# Altium schematic sheet DM1097_CM4_HS.SchDoc: =project_title
size Tabloid; CompanyName: Luxonis Holding; Organization: Luxonis Holding; Address1: 1925 Harmony Park Drive; Address2: Westminster, CO; Address3: 80234; Address4: United States; SheetNumber: 9; SheetTotal: 17
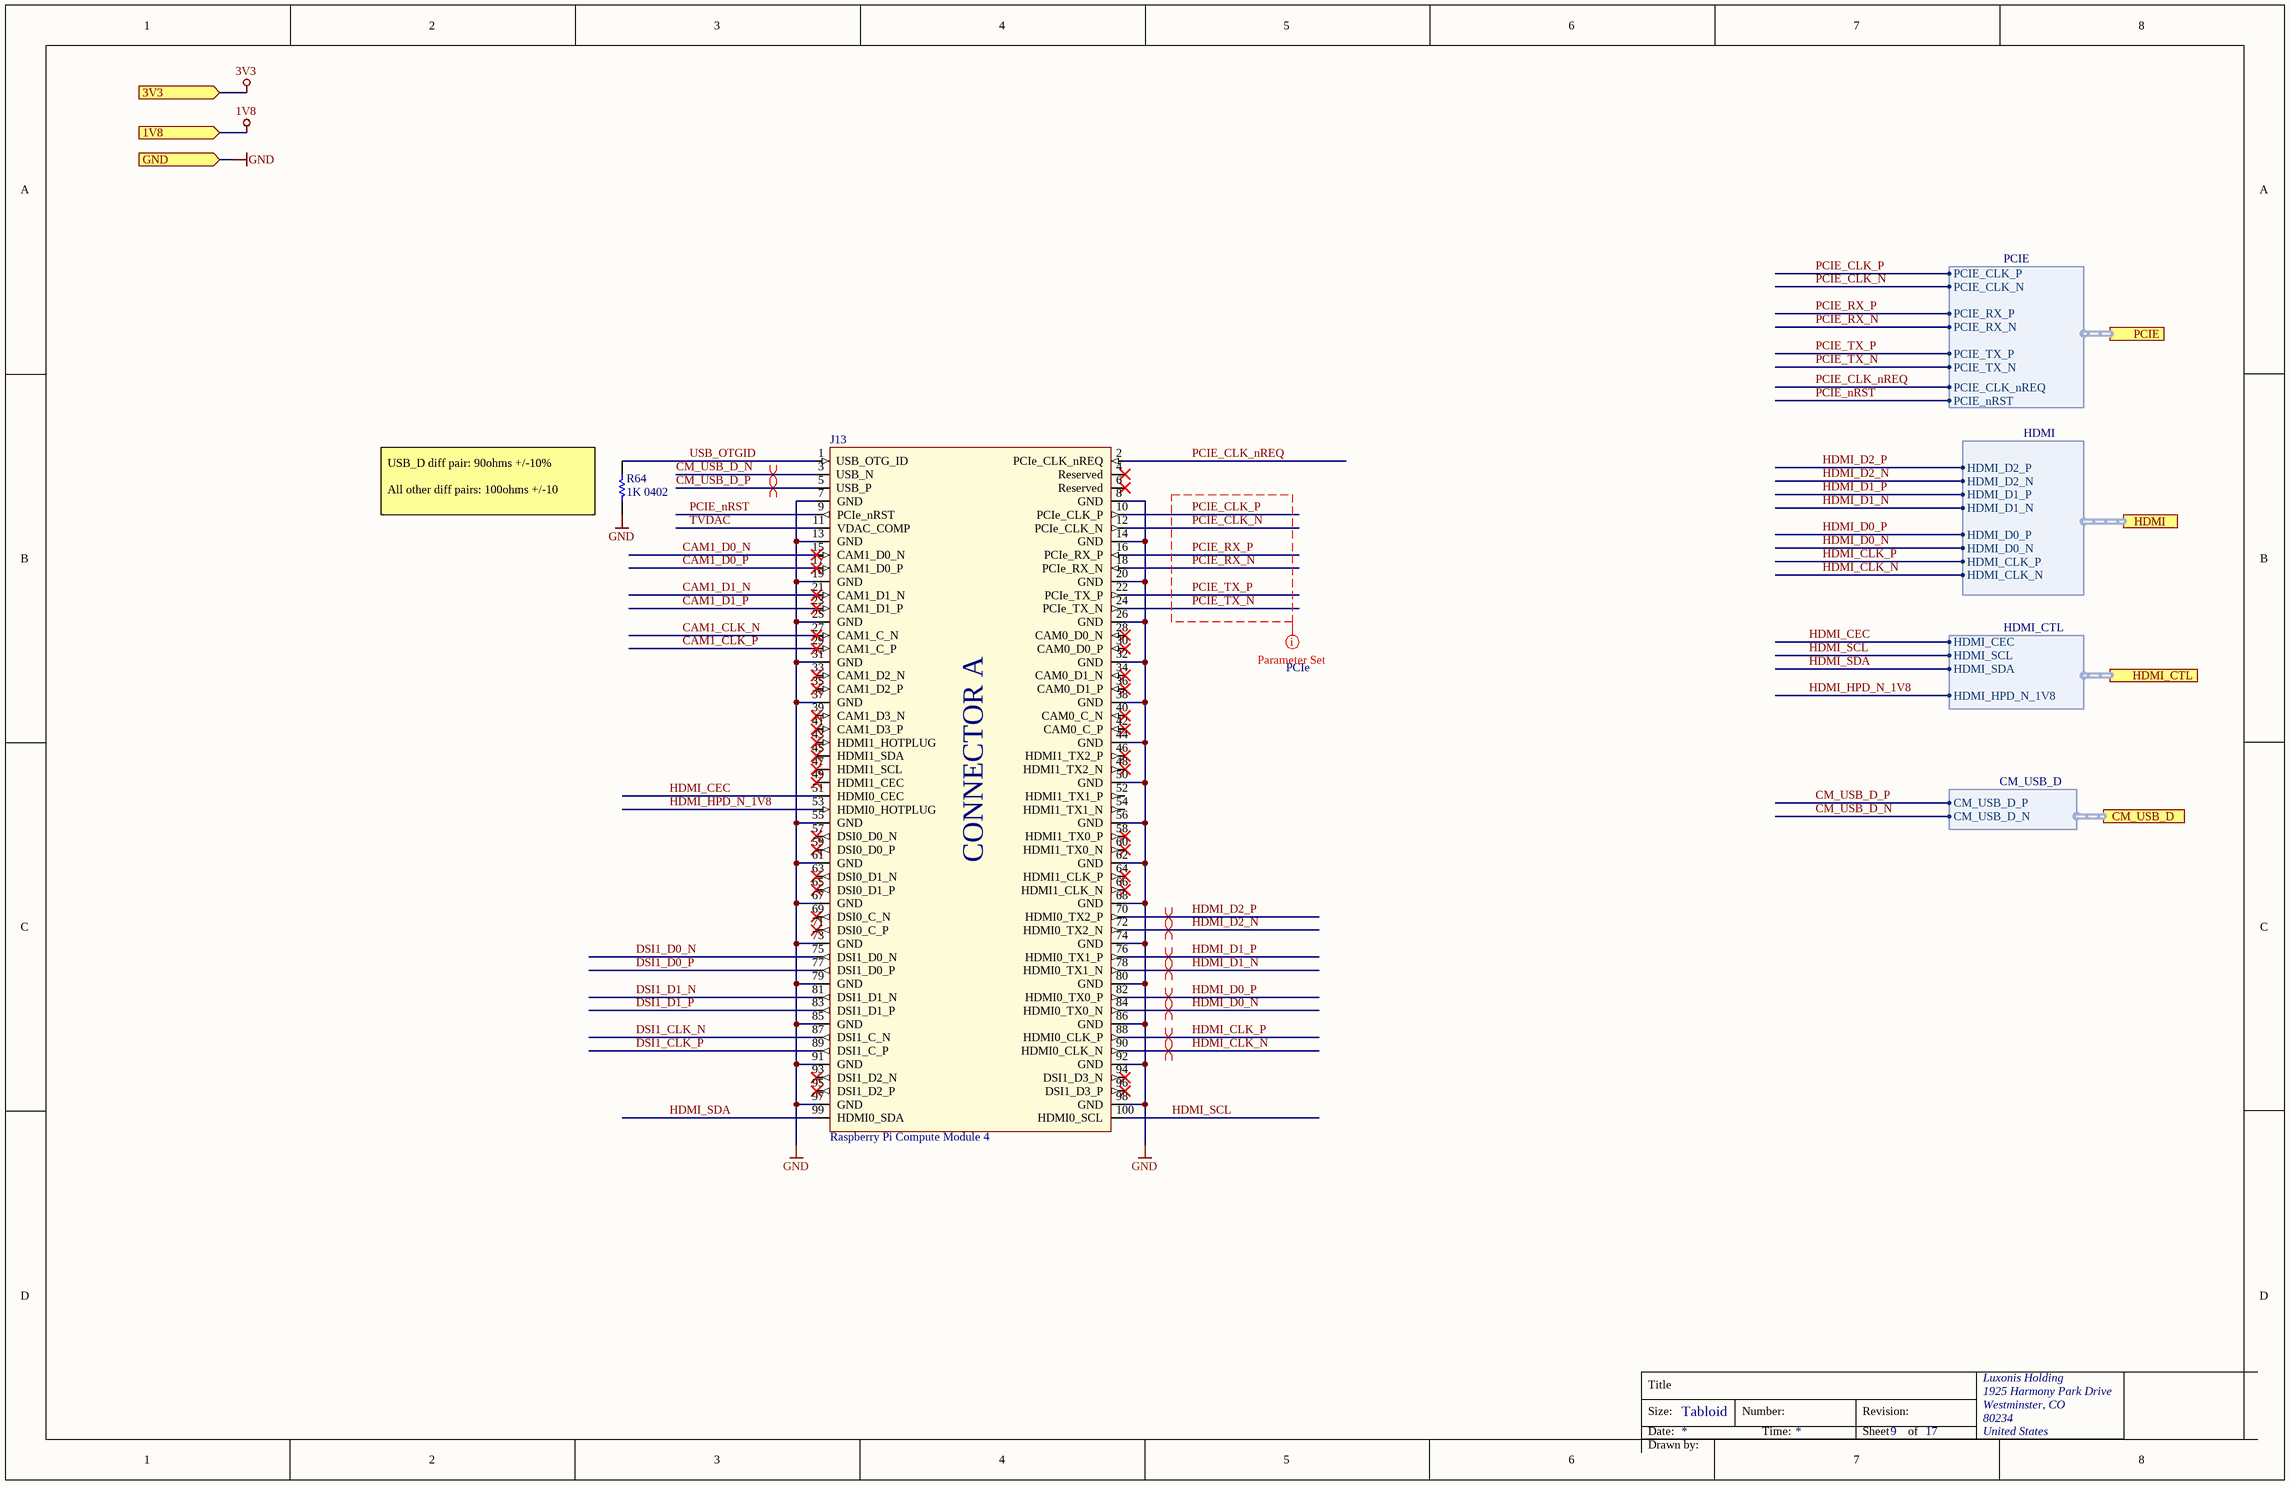
[diagram p0: DM1097_CM4_HS.SchDoc]

## Parts
J13  Raspberry Pi Compute Module 4  [CM4-Connector-A]
R64  1K 0402  [RESC0402(1005)_N]

## Ports
1V8 (in), 3V3 (in), CM_USB_D (harness CM_USB_D), GND (in), HDMI (harness HDMI), HDMI_CTL (harness HDMI_CTL), PCIE (harness PCIE)

## Harnesses
HDMI: HDMI_CLK_N, HDMI_CLK_P, HDMI_D0_N, HDMI_D0_P, HDMI_D1_N, HDMI_D1_P, HDMI_D2_N, HDMI_D2_P
CM_USB_D: CM_USB_D_P, CM_USB_D_N
HDMI_CTL: HDMI_CEC, HDMI_SCL, HDMI_SDA, HDMI_HPD_N_1V8
PCIE: PCIE_CLK_P, PCIE_CLK_N, PCIE_RX_P, PCIE_RX_N, PCIE_TX_N, PCIE_TX_P, PCIE_CLK_nREQ, PCIE_nRST

## Nets
1V8: port 1V8
3V3: port 3V3
GND: J13.7(GND) J13.8(GND) J13.13(GND) J13.14(GND) J13.19(GND) J13.20(GND) J13.25(GND) J13.26(GND) J13.31(GND) J13.32(GND) J13.37(GND) J13.38(GND) J13.44(GND) J13.50(GND) J13.55(GND) J13.56(GND) J13.61(GND) J13.62(GND) J13.67(GND) J13.68(GND) J13.73(GND) J13.74(GND) J13.79(GND) J13.80(GND) J13.85(GND) J13.86(GND) J13.91(GND) J13.92(GND) J13.97(GND) J13.98(GND) R64.1 ; port GND
CAM1_CLK_N: J13.27(CAM1_C_N)
CAM1_CLK_P: J13.29(CAM1_C_P)
CAM1_D0_N: J13.15(CAM1_D0_N)
CAM1_D0_P: J13.17(CAM1_D0_P)
CAM1_D1_N: J13.21(CAM1_D1_N)
CAM1_D1_P: J13.23(CAM1_D1_P)
CM_USB_D_N: J13.3(USB_N) ; port CM_USB_D.CM_USB_D_N
CM_USB_D_P: J13.5(USB_P) ; port CM_USB_D.CM_USB_D_P
DSI1_CLK_N: J13.87(DSI1_C_N)
DSI1_CLK_P: J13.89(DSI1_C_P)
DSI1_D0_N: J13.75(DSI1_D0_N)
DSI1_D0_P: J13.77(DSI1_D0_P)
DSI1_D1_N: J13.81(DSI1_D1_N)
DSI1_D1_P: J13.83(DSI1_D1_P)
HDMI_CEC: J13.51(HDMI0_CEC) ; port HDMI_CTL.HDMI_CEC
HDMI_CLK_N: J13.90(HDMI0_CLK_N) ; port HDMI.HDMI_CLK_N
HDMI_CLK_P: J13.88(HDMI0_CLK_P) ; port HDMI.HDMI_CLK_P
HDMI_D0_N: J13.84(HDMI0_TX0_N) ; port HDMI.HDMI_D0_N
HDMI_D0_P: J13.82(HDMI0_TX0_P) ; port HDMI.HDMI_D0_P
HDMI_D1_N: J13.78(HDMI0_TX1_N) ; port HDMI.HDMI_D1_N
HDMI_D1_P: J13.76(HDMI0_TX1_P) ; port HDMI.HDMI_D1_P
HDMI_D2_N: J13.72(HDMI0_TX2_N) ; port HDMI.HDMI_D2_N
HDMI_D2_P: J13.70(HDMI0_TX2_P) ; port HDMI.HDMI_D2_P
HDMI_HPD_N_1V8: J13.53(HDMI0_HOTPLUG) ; port HDMI_CTL.HDMI_HPD_N_1V8
HDMI_SCL: J13.100(HDMI0_SCL) ; port HDMI_CTL.HDMI_SCL
HDMI_SDA: J13.99(HDMI0_SDA) ; port HDMI_CTL.HDMI_SDA
PCIE_CLK_N: J13.12(PCIe_CLK_N) ; port PCIE.PCIE_CLK_N
PCIE_CLK_nREQ: J13.2(PCIe_CLK_nREQ) ; port PCIE.PCIE_CLK_nREQ
PCIE_CLK_P: J13.10(PCIe_CLK_P) ; port PCIE.PCIE_CLK_P
PCIE_nRST: J13.9(PCIe_nRST) ; port PCIE.PCIE_nRST
PCIE_RX_N: J13.18(PCIe_RX_N) ; port PCIE.PCIE_RX_N
PCIE_RX_P: J13.16(PCIe_RX_P) ; port PCIE.PCIE_RX_P
PCIE_TX_N: J13.24(PCIe_TX_N) ; port PCIE.PCIE_TX_N
PCIE_TX_P: J13.22(PCIe_TX_P) ; port PCIE.PCIE_TX_P
TVDAC: J13.11(VDAC_COMP)
USB_OTGID: J13.1(USB_OTG_ID) R64.2

Not connected (* = marked no-connect by the designer): J13 4(Reserved)* 6(Reserved)* 28(CAM0_D0_N)* 30(CAM0_D0_P)* 33(CAM1_D2_N)* 34(CAM0_D1_N)* 35(CAM1_D2_P)* 36(CAM0_D1_P)* 39(CAM1_D3_N)* 40(CAM0_C_N)* 41(CAM1_D3_P)* 42(CAM0_C_P)* 43(HDMI1_HOTPLUG)* 45(HDMI1_SDA)* 46(HDMI1_TX2_P)* 47(HDMI1_SCL)* 48(HDMI1_TX2_N)* 49(HDMI1_CEC)* 52(HDMI1_TX1_P) 54(HDMI1_TX1_N) 57(DSI0_D0_N)* 58(HDMI1_TX0_P)* 59(DSI0_D0_P)* 60(HDMI1_TX0_N)* 63(DSI0_D1_N)* 64(HDMI1_CLK_P)* 65(DSI0_D1_P)* 66(HDMI1_CLK_N)* 69(DSI0_C_N)* 71(DSI0_C_P)* 93(DSI1_D2_N)* 94(DSI1_D3_N)* 95(DSI1_D2_P)* 96(DSI1_D3_P)*

## Layout directives
differential pair; differential pair class 90ohm: CM_USB_D_N, CM_USB_D_P
differential pair; differential pair class 100ohm: HDMI_CLK_N, HDMI_CLK_P, HDMI_D0_N, HDMI_D0_P, HDMI_D1_N, HDMI_D1_P, HDMI_D2_N, HDMI_D2_P
net class PCIe: PCIE_CLK_N, PCIE_CLK_P, PCIE_RX_N, PCIE_RX_P, PCIE_TX_N, PCIE_TX_P

## Notes on the sheet
- (near R64) USB_D diff pair: 90ohms +/-10%
  All other diff pairs: 100ohms +/-10
- Title
- Size:
- Date:
- Tabloid
- Number:
- Time:
- Revision:
- Sheet
- of
- Drawn by:
- (in symbol CM4_CONNECTOR_A) CONNECTOR A

## Library data of the parts
J13 = CM4_CONNECTOR_A: Raspberry Pi Compute Module 4 Hirose connector A; Manufacturer Part Number 1: DF40HC(3.0)-100DS-0.4V(51; ComponentLink1Description: https://datasheet.ciiva.com/46636/ed-df40-20140305-46636517.pdf?src-supplier=Digi-Key; ComponentLink1URL: https://datasheet.ciiva.com/46636/ed-df40-20140305-46636517.pdf?src-supplier=Digi-Key; ComponentLink2Description: https://datasheet.ciiva.com/18562/ed-df40-20140305-18562189.pdf?src-supplier=Digi-Key; ComponentLink2URL: https://datasheet.ciiva.com/18562/ed-df40-20140305-18562189.pdf?src-supplier=Digi-Key; ComponentLink3Description: https://datasheet.ciiva.com/13559/ed-df40-20140305-13559540.pdf?src-supplier=Mouser; ComponentLink3URL: https://datasheet.ciiva.com/13559/ed-df40-20140305-13559540.pdf?src-supplier=Mouser; ComponentLink4Description: https://datasheet.ciiva.com/18562/ed-df40-20140305-18562462.pdf?src-supplier=Digi-Key; ComponentLink4URL: https://datasheet.ciiva.com/18562/ed-df40-20140305-18562462.pdf?src-supplier=Digi-Key; Manufacturer 1: Hirose
R64 = RC0402FR-071KL: RES SMD 1K OHM 1% 1/16W 0402 1 kOhms ±1% 0.063W, 1/16W Chip Resistor 0402 (1005 Metric) Moisture Resistant Thick Film; Manufacturer 1: Yageo; Temperature Coefficient: 100ppm/°C; Power Rating: 62.5mW; Voltage Rating (DC): 50V; Resistance: 1kR; Manufacturer Part Number 1: RC0402FR-071KL; RoHS: Yes; Number of Pins: 2; Case Code (Imperial): 0402; Case Code (Metric): 1005; Min Operating Temperature: -55°C; Max Operating Temperature: 155°C; Packaging: Tape and Reel; Composition: Thick Film; Voltage Rating: 50V; Military Standard: Not; Termination: SMD/SMT; Length: 1mm; Height: 0.32mm; Width: 0.5mm; Depth: 0.5mm; Lead Free: Lead Free; REACH SVHC: Unknown; ComponentLink1URL: https://datasheet.ciiva.com/11819/0900766b80c66297-11819477.pdf?src-supplier=RSComponents; ComponentLink1Description: https://datasheet.ciiva.com/11819/0900766b80c66297-11819477.pdf?src-supplier=RSComponents; ComponentLink2URL: https://datasheet.ciiva.com/12666/pyu-rc0402-51-rohs-l-6-r-12666741.pdf?src-supplier=Mouser; ComponentLink2Description: https://datasheet.ciiva.com/12666/pyu-rc0402-51-rohs-l-6-r-12666741.pdf?src-supplier=Mouser; ComponentLink3URL: https://datasheet.ciiva.com/17063/pyu-rc0402-51-rohs-l-6-r-17063193.pdf?src-supplier=Future+Electronics; ComponentLink3Description: https://datasheet.ciiva.com/17063/pyu-rc0402-51-rohs-l-6-r-17063193.pdf?src-supplier=Future+Electronics; ComponentLink4URL: https://datasheet.ciiva.com/22747/1018594-22747513.pdf?src-supplier=Element14; ComponentLink4Description: https://datasheet.ciiva.com/22747/1018594-22747513.pdf?src-supplier=Element14; ComponentLink5URL: https://datasheet.ciiva.com/7849/1018594-7849869.pdf?src-supplier=Element14; ComponentLink5Description: https://datasheet.ciiva.com/7849/1018594-7849869.pdf?src-supplier=Element14; ComponentLink6URL: https://datasheet.ciiva.com/7983/1018594-7983502.pdf?src-supplier=Element14; ComponentLink6Description: https://datasheet.ciiva.com/7983/1018594-7983502.pdf?src-supplier=Element14; ComponentLink7URL: https://datasheet.ciiva.com/7849/1018594-7849871.pdf?src-supplier=Element14; ComponentLink7Description: https://datasheet.ciiva.com/7849/1018594-7849871.pdf?src-supplier=Element14; Supplier 1: Digi-Key; Stock 1: 60695854; Pricing 1: 1=0.10000, 10=0.01600, 100=0.00670, 1000=0.00301, 2500=0.00261, 5000=0.00215 (USD); Case/Package: 0402; Tolerance: 1%; Supplier Part Number 1: 311-1.00KLRCT-ND